# Altium project ha_light_switch.PrjPcb
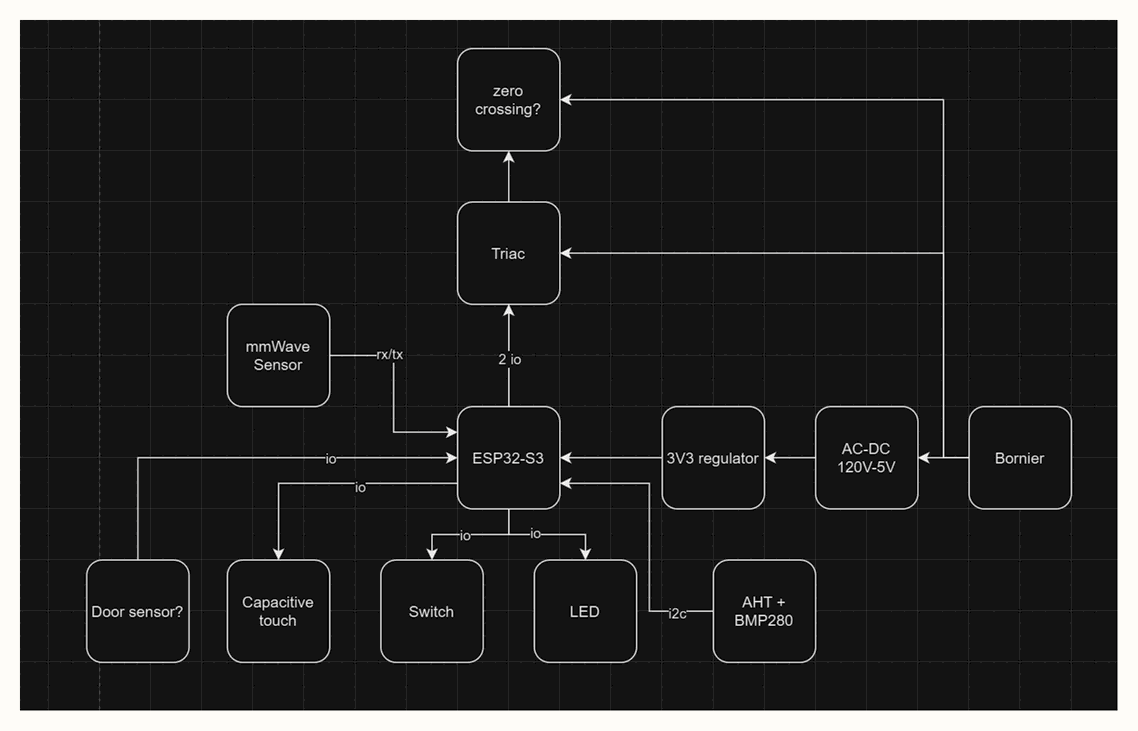
[diagram p0: Overview.SchDoc]
3 sheets, 44 parts. Net scope: global (net labels, ports and power ports of the same name join across sheets).
Board file: ha_light_switch.PcbDoc
Sheets:
  Overview.SchDoc
  ha_light_swich.SchDoc
  ha_light_switch-power.SchDoc

## Sheet Overview.SchDoc
size A4; DrawnBy: Emile Renaud; Revision: V1.0; SheetNumber: 1; SheetTotal: 3

### Notes on the sheet
- Title:
- Date:
- Size:
- B
- Drawn by:
- Checked by:
- Sheet
- of
- Revision:
- File:

## Sheet ha_light_swich.SchDoc
size A4; DrawnBy: Emile Renaud; Revision: V1.0; SheetNumber: 2; SheetTotal: 3
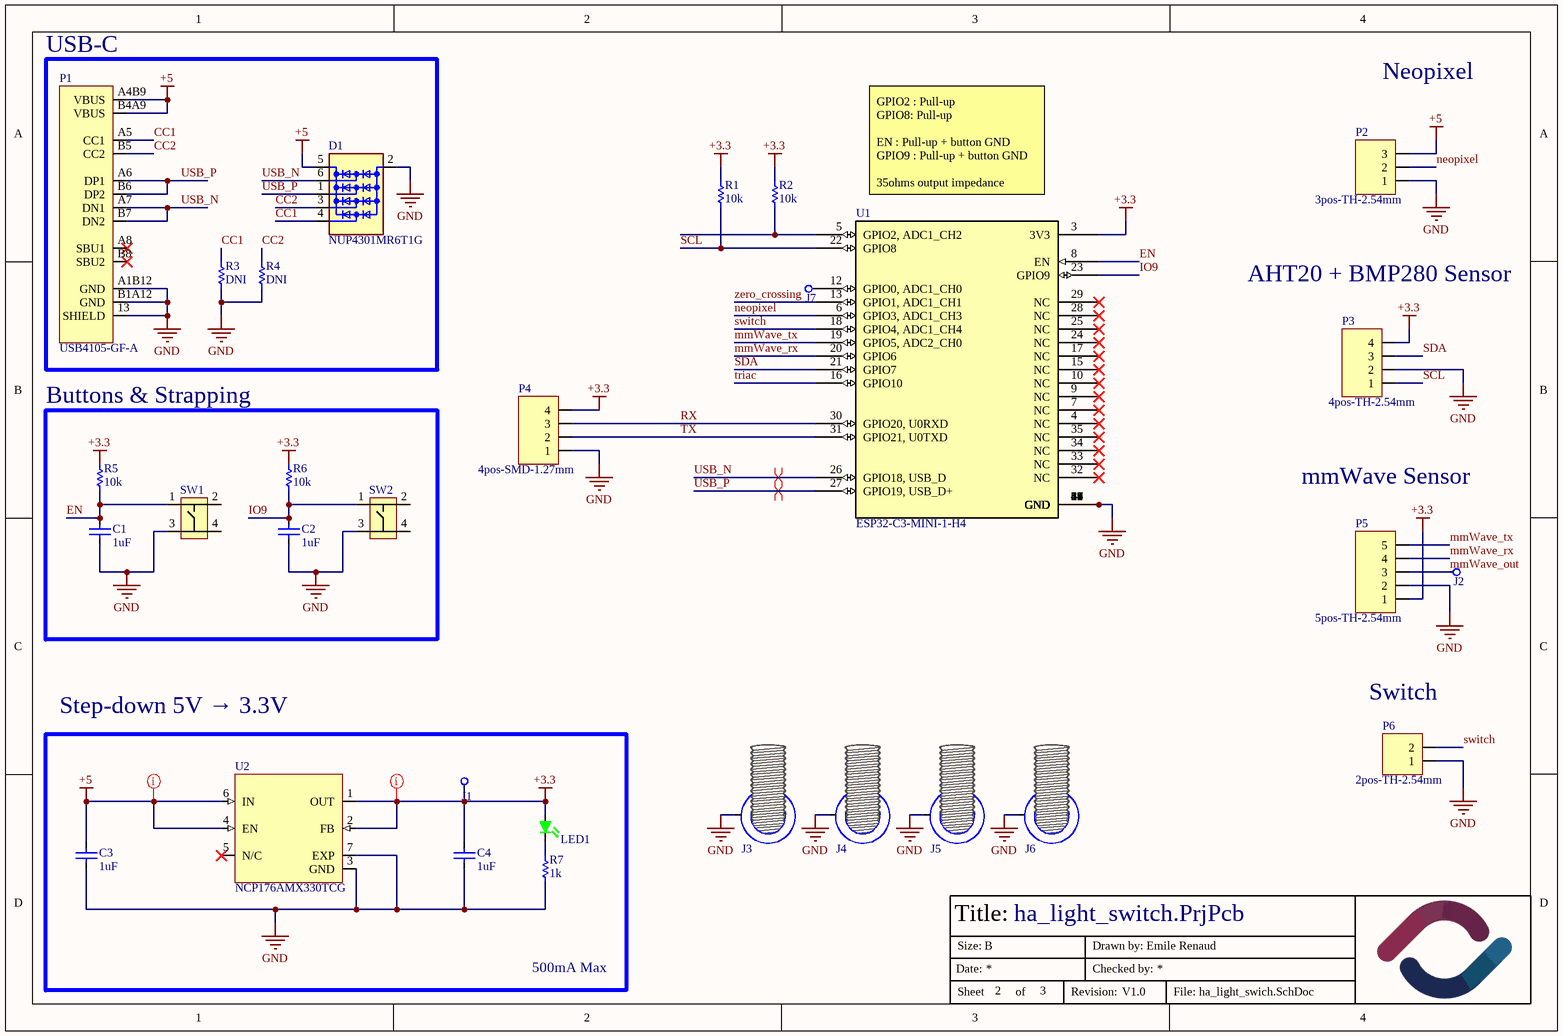
[diagram p1: ha_light_swich.SchDoc]

### Parts
C1  value 1uF  [CAPACITOR-0603]  (hidden comment: Capacitor-0603-1uF-25V-X5R)
C2  value 1uF  [CAPACITOR-0603]  (hidden comment: Capacitor-0603-1uF-25V-X5R)
C3  value 1uF  [CAPACITOR-0603]  (hidden comment: Capacitor-0603-1uF-25V-X5R)
C4  value 1uF  [CAPACITOR-0603]  (hidden comment: Capacitor-0603-1uF-25V-X5R)
D1  NUP4301MR6T1G  [SOT-23-6]
J1  hole  [PAD-1.2MM-silk]  (value not drawn)  (no BOM)
J2  hole  [PAD-1.2MM]  (value not drawn)  (no BOM)
J3  hole  [HOLE-3.40MM-M3-8MMEYELET]  (value not drawn)  (no BOM)
J4  hole  [HOLE-3.40MM-M3-8MMEYELET]  (value not drawn)  (no BOM)
J5  hole  [HOLE-3.40MM-M3-8MMEYELET]  (value not drawn)  (no BOM)
J6  hole  [HOLE-3.40MM-M3-8MMEYELET]  (value not drawn)  (no BOM)
J7  hole  [PAD-1.2MM]  (value not drawn)  (no BOM)
LED1  3147-B1911NG--20D000214U1930CT-ND  [LED-0603-2PIN-SILKSCREEN]  (value not drawn)
P1  USB4105-GF-A  [USB-C]
P2  3pos-TH-2.54mm  [HDR1X3]
P3  4pos-TH-2.54mm  [HDR1X4]
P4  4pos-SMD-1.27mm  [HDR1X4-SMD-50mils]
P5  5pos-TH-2.54mm  [HDR1X5]
P6  2pos-TH-2.54mm  [HDR1X2]
R1  value 10k  [Resistor-0603]  (hidden comment: SMT resistor)
R2  value 10k  [Resistor-0603]  (hidden comment: SMT resistor)
R3  value DNI  [RESISTOR-0603]  (hidden comment: Resistor-0603-5.1k)
R4  value DNI  [RESISTOR-0603]  (hidden comment: Resistor-0603-5.1k)
R5  value 10k  [Resistor-0603]  (hidden comment: SMT resistor)
R6  value 10k  [Resistor-0603]  (hidden comment: SMT resistor)
R7  value 1k  [Resistor-0603]  (hidden comment: SMT resistor)
SW1  PTS815 SJM 250 SMTR LFS  [SW4_PTS815 SJM 250 SMTR LFS_CNK]  (value not drawn)
SW2  PTS815 SJM 250 SMTR LFS  [SW4_PTS815 SJM 250 SMTR LFS_CNK]  (value not drawn)
U1  ESP32-C3-MINI-1-H4  [ESP32-C3-MINI-1_EXP]
U2  NCP176AMX330TCG  [XFDFN-6 Exposed Pad]

### Blocks framed on the sheet
USB-C: D1 P1 R3 R4
Buttons & Strapping: C1 C2 R5 R6 SW1 SW2
Step-down 5V → 3.3V: C3 C4 J1 LED1 R7 U2

### Nets
+3.3: C4.2 J1.1 LED1.2(R) P3.4 P4.4 P5.1 R1.2 R2.2 R5.2 R6.2 U1.3(3V3) U2.1(OUT) U2.2(FB)
+5: C3.2 D1.5(VDD) P1.A4B9(VBUS) P1.B4A9(VBUS) P2.3 U2.4(EN) U2.6(IN)
GND: C1.1 C2.1 C3.1 C4.1 D1.2(GND) J3.1 J4.1 J5.1 J6.1 P1.13(SHIELD) P1.A1B12(GND) P1.B1A12(GND) P2.1 P3.2 P4.1 P5.2 P6.1 R3.1 R4.1 R7.1 SW1.3 SW2.3 U1.1(GND) U1.2(GND) U1.11(GND) U1.14(GND) U1.36(GND) U1.37(GND) U1.38(GND) U1.39(GND) U1.40(GND) U1.41(GND) U1.42(GND) U1.43(GND) U1.44(GND) U1.45(GND) U1.46(GND) U1.47(GND) U1.48(GND) U1.49(GND) U1.50(GND) U1.51(GND) U1.52(GND) U1.53(GND) U1.54(GND) U1.55(GND) U1.56(GND) U1.57(GND) U1.58(GND) U1.59(GND) U1.60(GND) U1.61(GND) U2.3(GND) U2.7(EXP)
CC1: D1.4(L4) P1.A5(CC1) R3.2
CC2: D1.3(L3) P1.B5(CC2) R4.2
EN: C1.2 R5.1 SW1.1 U1.8(EN)
IO9: C2.2 R6.1 SW2.1 U1.23(GPIO9)
mmWave_out: J2.1 P5.3
mmWave_rx: P5.4 U1.20(GPIO6)
mmWave_tx: P5.5 U1.19(GPIO5,_ADC2_CH0)
neopixel: P2.2 U1.6(GPIO3,_ADC1_CH3)
RX: P4.3 U1.30(GPIO20,_U0RXD)
SCL: P3.1 R1.1 U1.22(GPIO8)
SDA: P3.3 U1.21(GPIO7)
switch: P6.2 U1.18(GPIO4,_ADC1_CH4)
triac: U1.16(GPIO10)
TX: P4.2 U1.31(GPIO21,_U0TXD)
USB_N: D1.6(L1) P1.A7(DN1) P1.B7(DN2) U1.26(GPIO18,_USB_D)
USB_P: D1.1(L2) P1.A6(DP1) P1.B6(DP2) U1.27(GPIO19,_USB_D+)
zero_crossing: U1.13(GPIO1,_ADC1_CH1)
NetJ7_1: J7.1 U1.12(GPIO0,_ADC1_CH0)
NetLED1_1: LED1.1(K) R7.2
NetR2_1: R2.1 U1.5(GPIO2,_ADC1_CH2)

Not connected (* = marked no-connect by the designer): P1 A8(SBU1)* B8(SBU2)*; SW1 2 4; SW2 2 4; U1 4(NC)* 7(NC)* 9(NC)* 10(NC)* 15(NC)* 17(NC)* 24(NC)* 25(NC)* 28(NC)* 29(NC)* 32(NC)* 33(NC)* 34(NC)* 35(NC)*; U2 5(N/C)*

### Layout directives
net class LOW_POWER: +3.3, +5
differential pair: USB_N, USB_P

### Notes on the sheet
- Neopixel
- (near U1) GPIO2 : Pull-up
  GPIO8: Pull-up
  EN : Pull-up + button GND
  GPIO9 : Pull-up + button GND
  35ohms output impedance
- AHT20 + BMP280 Sensor
- mmWave Sensor
- (near P6) Switch
- 500mA Max
- Title:
- Date:
- Size:
- B
- Drawn by:
- Checked by:
- Sheet
- of
- Revision:
- File:

### Library data of the parts
C1-C4 = Capacitor-0603-1uF-25V-X5R: Precision: X5R-10%; Volt: 25V; Package / Case: Metric 1608, EIA 0603; Mounted: Yes; Supplier 1: Digi-Key; Supplier Part Number 1: 1276-1859-2-ND; Supplier 2: Digi-Key; Supplier Part Number 2: 1276-1942-2-ND
D1 = NUP4301MR6T1G: 4CH Clamp Ipp Tvs Diode Surface Mount SOT23-6 (SC74); Volt: 70; Supplier 1: Digi-Key; Supplier Part Number 1: NUP4301MR6T1GOSTR-ND; Mounted: Yes; Package / Case: SOT23-6
J1 J2 J7 = PAD 1.2mm: Mounted: N/A
J3-J6 = Hole 3.40mm M3-Eyelet: Hole for M3 Bolt with 8mm pad; Mounted: N/A
LED1 = LED_GREEN: LED GREEN DIFFUSED 0603 SMD; Package / Case: 0603 (1608 Metric); Mounted: Yes; Supplier 1: Digi-Key; Supplier Part Number 1: 3147-B1911NG--20D000214U1930CT-ND
P1 = USB4105-GF-A: CONN RCP USB2.0 TYP C 24P SMD RA / 5A; Supplier 1: Digikey; Supplier Part Number 1: 2073-USB4105-GF-ACT-ND; Mounted: Yes; Package / Case: SMD; Volt: N/A
P2 = 3pos-TH-2.54mm: 3pos TH 2.54mm Header; Supplier 1: Digi-Key; Supplier Part Number 1: N/A; Mounted: Yes; Package / Case: TH; Volt: N/A
P3 = 4pos-TH-2.54mm: 4pos TH 2.54mm Header; Supplier 1: Digi-Key; Supplier Part Number 1: N/A; Mounted: Yes; Package / Case: TH; Volt: N/A
P4 = 4pos-SMD-1.27mm: 4pos SMD 1.27mm; Supplier 1: Digi-Key; Supplier Part Number 1: N/A; Mounted: Yes; Package / Case: TH; Volt: N/A
P5 = 5pos-TH-2.54mm: 5pos TH 2.54mm Header; Supplier 1: Digi-Key; Supplier Part Number 1: N/A; Mounted: Yes; Package / Case: TH; Volt: N/A
P6 = 2pos-TH-2.54mm: 2pos TH 2.54mm Header; Supplier 1: Digi-Key; Supplier Part Number 1: N/A; Mounted: Yes; Package / Case: TH; Volt: N/A
R1 R2 R5 R6 = Resistor0603-10k: Precision: 1%; Watt: 0.1W; Mounted: Yes; Package / Case: Metric 1608, EIA 0603; Supplier 2: Digi-Key; Supplier 4: Digi-Key; Supplier Part Number 2: RMCF0603FT10K0TR-ND; Supplier 1: Digi-Key; Supplier 3: Digi-Key; Supplier Part Number 1: 311-10.0KHRTR-ND
R3 R4 = Resistor-0603-DNI: 0603 footprint DO NOT INSTALL; Mounted: Yes; Package/Case: Metric 1608 , EIA 0603
R7 = Resistor0603-1k: Precision: 1%; Watt: 0.1W; Mounted: Yes; Package / Case: Metric 1608, EIA 0603; Supplier 2: Digi-Key; Supplier 4: Digi-Key; Supplier Part Number 2: 311-1.00KHRTR-ND; Supplier 1: Digi-Key; Supplier 3: Digi-Key; Supplier Part Number 1: RMCF0603FT1K00TR-ND; Supplier Part Number 3: AG1307TR-ND
SW1 SW2 = PTS815 SJM 250 SMTR LFS: TACT 4.2 X 3.2, 2.5 MM H, 180GF,; Volt: 12V; Current: 0.05A; Supplier 1: Digi-Key; Supplier Part Number 1: CKN12215-1-ND; Mounted: Yes
U1 = ESP32-C3-MINI-1-N4: Bluetooth, WiFi 802.11b/g/n, Bluetooth v5.0 Transceiver Module 2.412GHz ~ 2.484GHz PCB Trace Surface Mount; Mfr_Name: Espressif Systems; Copyright: Copyright (C) 2023 Ultra Librarian. All rights reserved.; Manufacturer_Part_Number: ESP32-C3-MINI-1-N4; RefDes: RefDes; Type: Type; Datasheet: https://www.espressif.com/sites/default/files/documentation/esp32-c3-mini-1_datasheet_en.pdf
U2 = NCP176AMX330TCG: IC REG LINEAR 3.3V 500mA 6-XDFN; Supplier 1: Digi-Key; Supplier Part Number 1: NCP176AMX330TCGOSCT-ND; Package / Case: 6-XDFN; Mounted: Yes; HelpURL: https://www.onsemi.com/pdf/datasheet/ncp176-d.pdf

## Sheet ha_light_switch-power.SchDoc
size A4; DrawnBy: Emile Renaud; Revision: V1.0; SheetNumber: 3; SheetTotal: 3
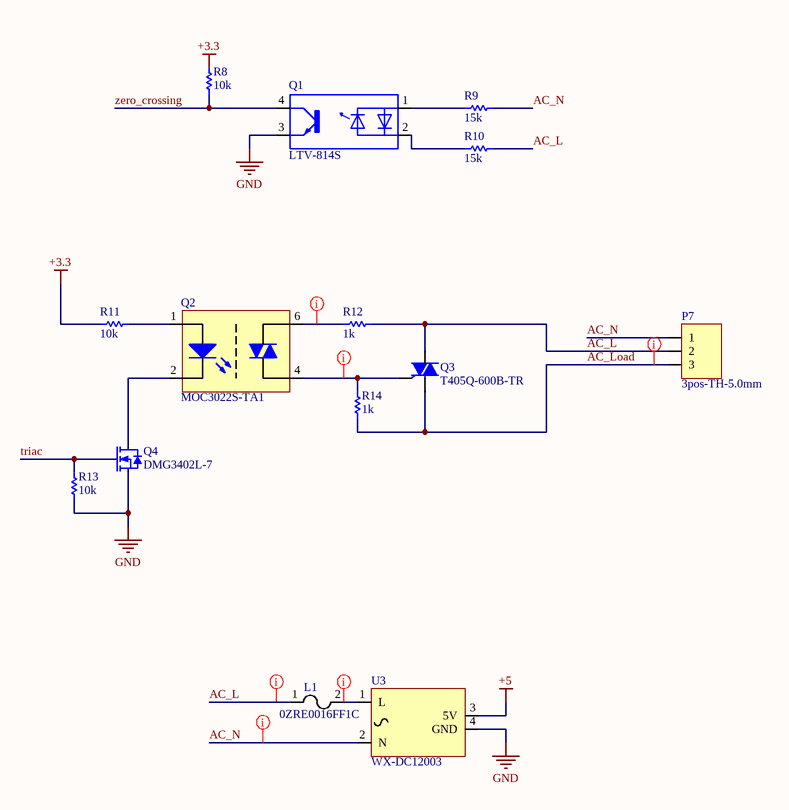
[diagram p2: ha_light_switch-power.SchDoc]

### Parts
L1  0ZRE0016FF1C  [0ZRE0016FF1C-PTC]
P7  3pos-TH-5.0mm  [Weco 3]
Q1  LTV-814S  [SMD-4-LTV814]
Q2  MOC3022S-TA1  [SMD-6]
Q3  T405Q-600B-TR  [TO-252-3/DPAK]
Q4  DMG3402L-7  [SOT-23-3]
R8  value 10k  [Resistor-0603]  (hidden comment: SMT resistor)
R9  value 15k  [RESISTOR-2512]  (hidden comment: SMT resistor)
R10  value 15k  [RESISTOR-2512]  (hidden comment: SMT resistor)
R11  value 10k  [Resistor-0603]  (hidden comment: SMT resistor)
R12  value 1k  [RESISTOR-2512]  (hidden comment: SMT resistor)
R13  value 10k  [Resistor-0603]  (hidden comment: SMT resistor)
R14  value 1k  [RESISTOR-2512]  (hidden comment: SMT resistor)
U3  WX-DC12003  [WX-DC12003]

### Nets
+3.3: R8.2 R11.2
+5: U3.3(5V)
GND: Q1.3 Q4.2(S) R13.2 U3.4(GND)
AC_L: L1.1 P7.2 Q3.2(A2) R10.2 R12.2
AC_Load: P7.3 Q3.1(A1) R14.1
AC_N: P7.1 R9.2 U3.2(N)
triac: Q4.1(G) R13.1
zero_crossing: Q1.4 R8.1
NetL1_2: L1.2 U3.1(L)
NetQ1_1: Q1.1 R9.1
NetQ1_2: Q1.2 R10.1
NetQ2_1: Q2.1(Anode) R11.1
NetQ2_2: Q2.2(Cathode) Q4.3(D)
NetQ2_4: Q2.4(GND) Q3.3(G) R14.2
NetQ2_6: Q2.6(Vdd) R12.1

### Layout directives
net class AC: AC_L, AC_Load, AC_N, NetL1_2, NetQ2_4, NetQ2_6

### Notes on the sheet
- Title:
- Date:
- Size:
- B
- Drawn by:
- Checked by:
- Sheet
- of
- Revision:
- File:

### Library data of the parts
L1 = 0ZRE0016FF1C: PTC RESET FUSE 240V 160MA RADIAL; Current: 5A; Precision: 20%; Supplier 1: Digi-Key; Mounted: Yes; Supplier Part Number 1: 308-2498-1-ND; Package / Case: SMD
P7 = 3P-TH-5.0mm: 3pos-TH-5.0mm Screw Terminal; Supplier 1: Digi-Key; Supplier Part Number 1: 277-1667-ND; Mounted: Yes; Package / Case: TH; Volt: N/A
Q1 = LTV-814S: Optoisolator Transistor Output 5000Vrms 1 Channel 4-SMD; Supplier 1: Digi-Key; Supplier Part Number 1: 160-LTV-814S-TA1-ACT-ND; Package / Case: 4-SMD; Mounted: Yes
Q2 = MOC3022S-TA1: OPTOISOLATOR 5KV TRIAC 6SMD; Supplier 1: Digi-Key; Supplier Part Number 1: 160-2046-1-ND; Package / Case: 6-SMD; Mounted: Yes
Q3 = T405Q-600B-TR: TRIAC SENS GATE 600V 4A DPAK; Supplier 1: Digi-Key; Supplier Part Number 1: 497-2501-1-ND; Volt: 600V; Package / Case: TO-252-3; Mounted: Yes; Current: 4A
Q4 = DMG3402L-7: N-Channel 30 V 4A (Ta) 1.4W (Ta) Surface Mount SOT-23-3; Volt: 30V; Supplier 1: Digi-Key; Supplier Part Number 1: DMG3402L-7DICT-ND; Package / Case: SOT-23-3; Mounted: Yes; Current: 4A
R8 R11 R13 = Resistor-0603-10k: Resistor0603-10k; Precision: 1%; Watt: 0.1W; Mounted: Yes; Package / Case: Metric 1608, EIA 0603; Supplier 1: Digi-Key; Supplier Part Number 1: 311-10.0KHRTR-ND
R9 R10 = Resistor-2512-15k: Precision: 1%; Watt: 1W; Mounted: Yes; Package / Case: Metric 6432,  EIA 2512; Supplier 1: Digi-Key; Supplier Part Number 1: 541-15.0KAFCT-ND
R12 R14 = Resistor-2512-1k: Precision: 1%; Watt: 1W; Mounted: Yes; Package / Case: Metric 6432,  EIA 2512; Supplier 1: Digi-Key; Supplier Part Number 1: 541-1.00KAFCT-ND
U3 = WX-DC12003: AC/DC Isolated converter. 50-277AC -> 5Vdc; Grade: None; Supplier 1: Aliexpress; Supplier Part Number 1: WX-DC12003; HelpURL: https://www.aerial.net/shop/product/54_250/2321/85265v-ac-to-5v.html

## Nets that join several sheets
+3.3: ha_light_swich (13 pins), ha_light_switch-power (R8.2 R11.2)
+5: ha_light_swich (7 pins), ha_light_switch-power (U3.3)
GND: ha_light_swich (54 pins), ha_light_switch-power (Q1.3 Q4.2 R13.2 U3.4)
triac: ha_light_swich (U1.16), ha_light_switch-power (Q4.1 R13.1)
zero_crossing: ha_light_swich (U1.13), ha_light_switch-power (Q1.4 R8.1)